# Altium schematic sheet P06 PHY 1.SchDoc
size 420 x 297 mm
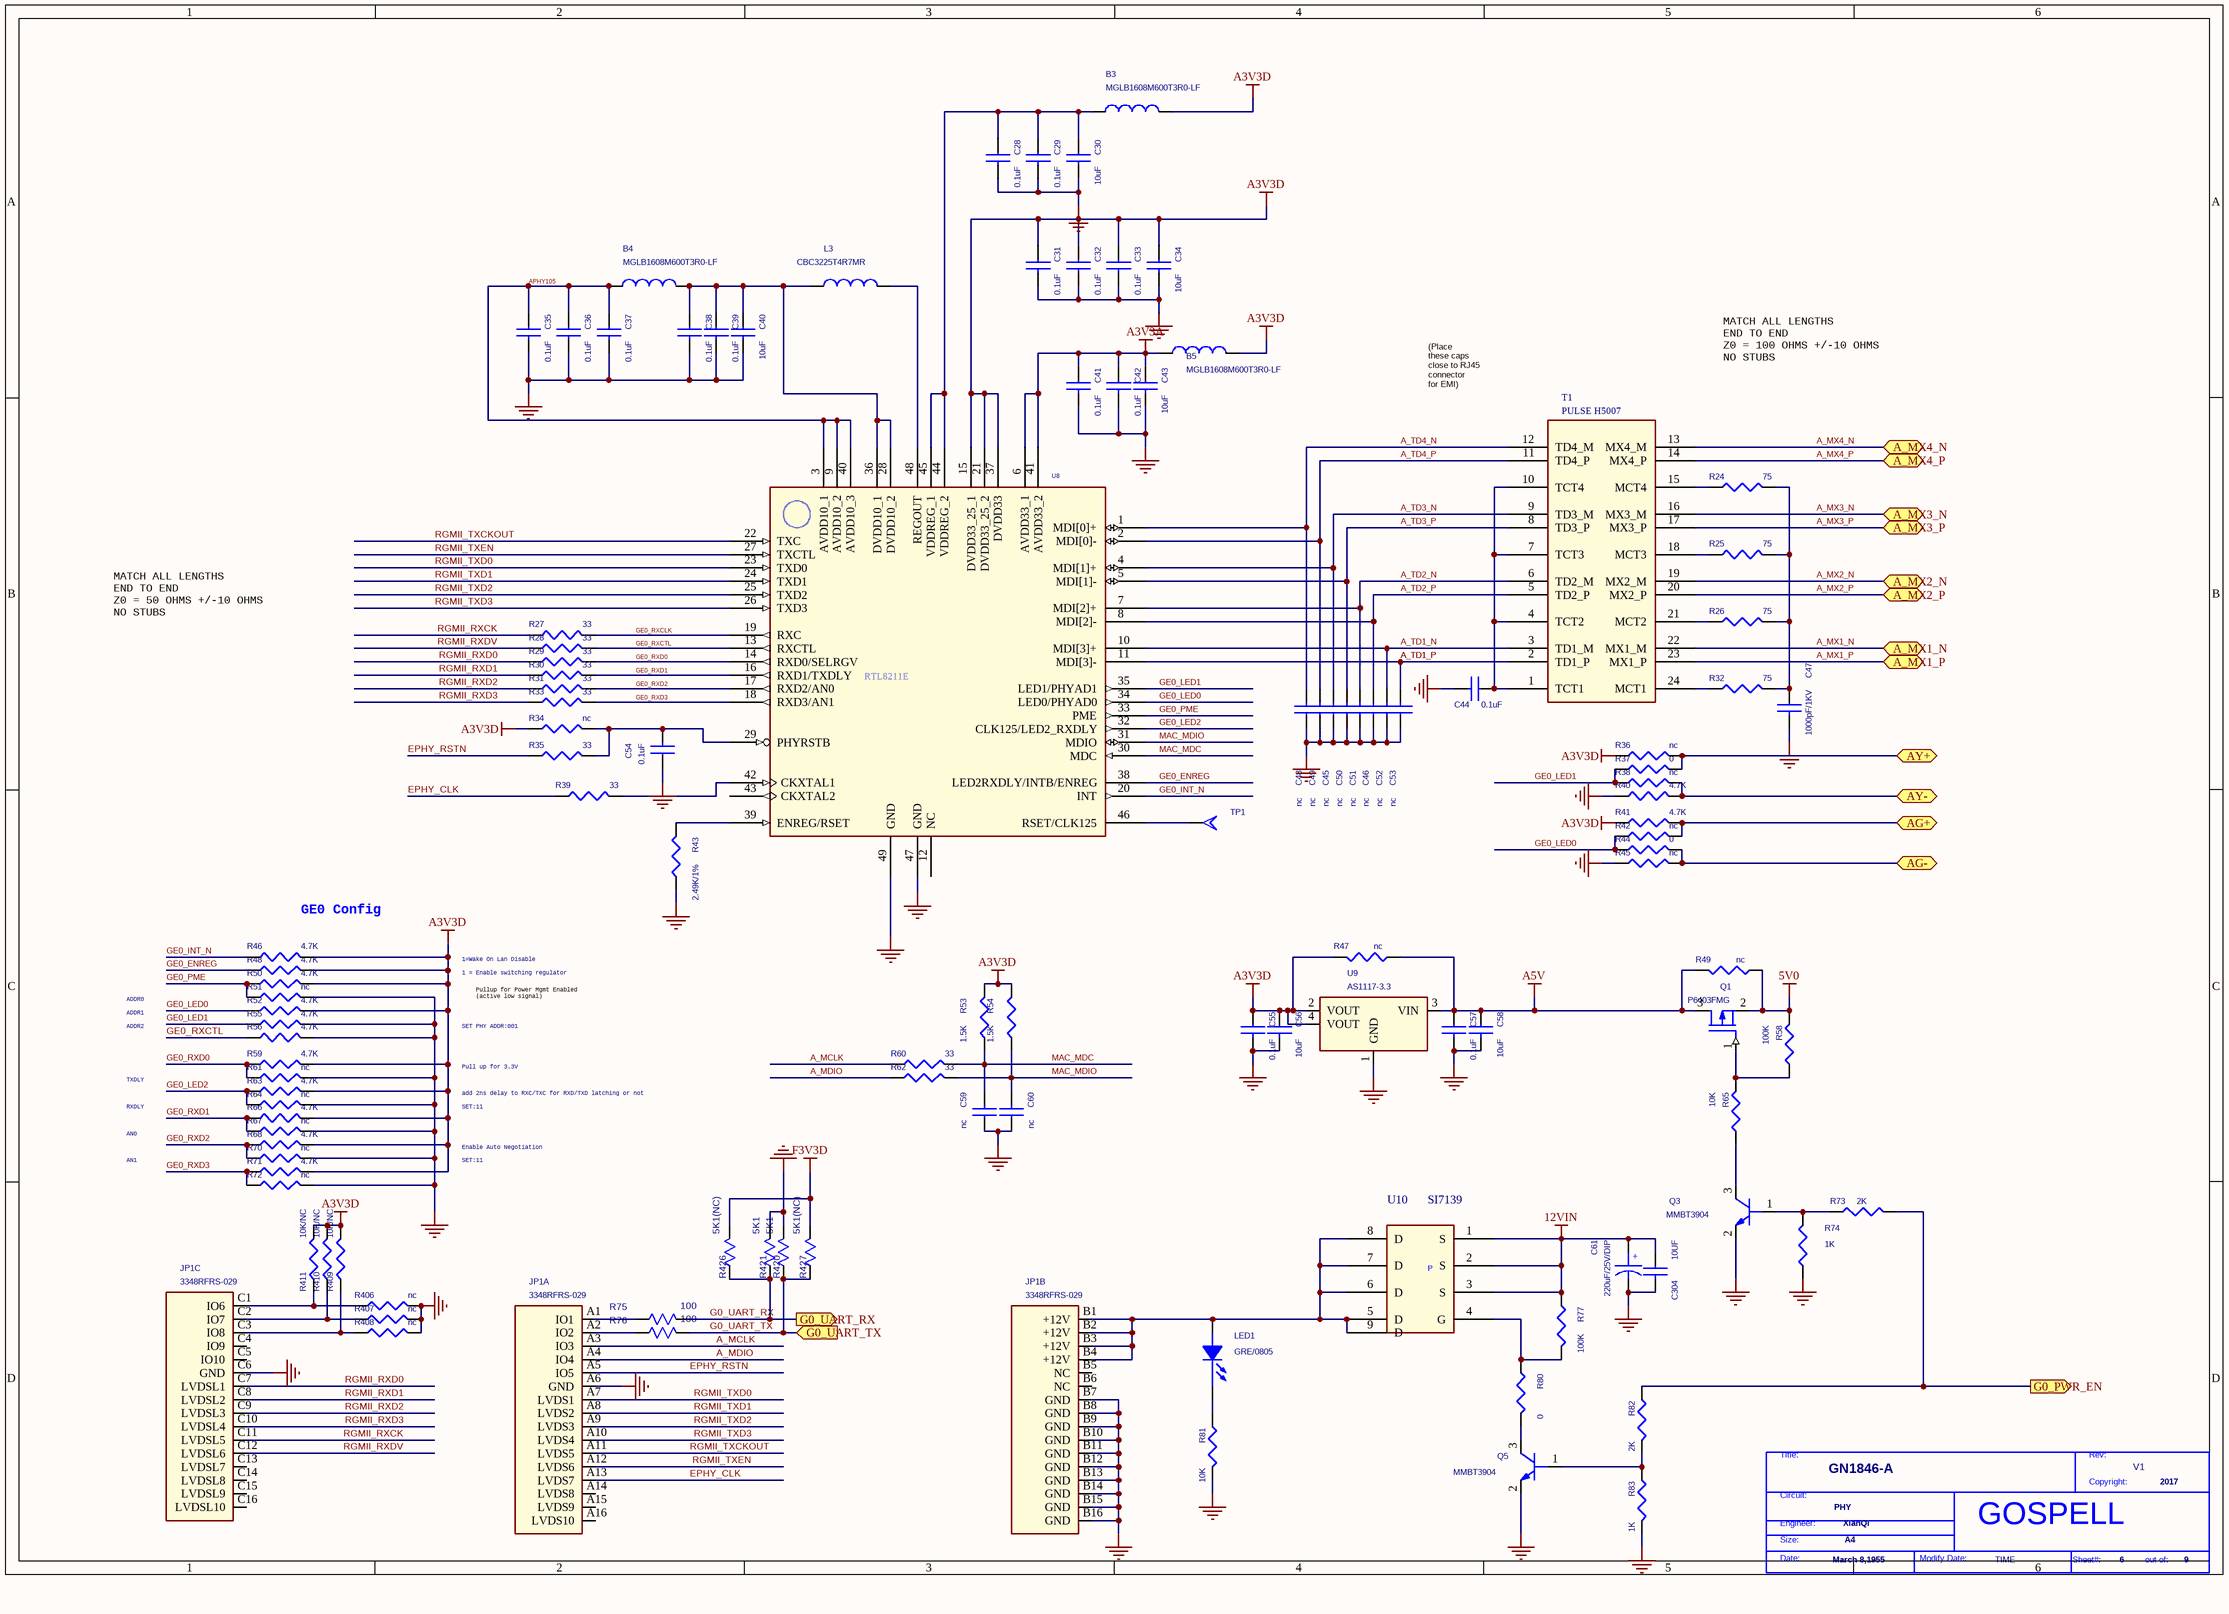
[diagram p0: P06 PHY 1.SchDoc]

## Parts
*  Doc: PHY  Page Count: 9  Page Number: 6  Page Create Date: March 8,1955  Page Size: A4  RevCode: V1  Title: GN1846-A  Copyright: 2017  Engineer: XianQi  Page Modify Date: TIME  (hidden comment: GOSPELL)  (graphical)
B3  MGLB1608M600T3R0-LF  [L0603]
B4  MGLB1608M600T3R0-LF  [L0603]
B5  MGLB1608M600T3R0-LF  [L0603]
C28  0.1uF  [0402C]
C29  0.1uF  [0402C]
C30  10uF  [C0603]
C31  0.1uF  [0402C]
C32  0.1uF  [0402C]
C33  0.1uF  [0402C]
C34  10uF  [C0603]
C35  0.1uF  [0402C]
C36  0.1uF  [0402C]
C37  0.1uF  [0402C]
C38  0.1uF  [0402C]
C39  0.1uF  [0402C]
C40  10uF  [C0603]
C41  0.1uF  [0402C]
C42  0.1uF  [0402C]
C43  10uF  [C0603]
C44  0.1uF  [0402C]
C45  nc  [0402C]
C46  nc  [0402C]
C47  1000pF/1KV  [C1206]
C48  nc  [0402C]
C49  nc  [0402C]
C50  nc  [0402C]
C51  nc  [0402C]
C52  nc  [0402C]
C53  nc  [0402C]
C54  0.1uF  [0402C]
C55  0.1uF  [0402C]
C56  10uF  [C0603]
C57  0.1uF  [0402C]
C58  10uF  [C0603]
C59  nc  [0402C]
C60  nc  [0402C]
C61  220uF/25V/DIP  [CE8X3.5]
C304  10UF  [C1206]
JP1  3348RFRS-029  [3348RFRS-029]  (parts A,B,C of 3)
L3  CBC3225T4R7MR  [FB0805]
LED1  GRE/0805  [LED0805]
Q1  P6403FMG  [SOT23]
Q3  MMBT3904  [SOT23]
Q5  MMBT3904  [SOT23]
R24  75  [0402R]
R25  75  [0402R]
R26  75  [0402R]
R27  33  [0402R]
R28  33  [0402R]
R29  33  [0402R]
R30  33  [0402R]
R31  33  [0402R]
R32  75  [0402R]
R33  33  [0402R]
R34  nc  [0402R]
R35  33  [0402R]
R36  nc  [0402R]
R37  0  [0402R]
R38  nc  [0402R]
R39  33  [0402R]
R40  4.7K  [0402R]
R41  4.7K  [0402R]
R42  nc  [0402R]
R43  2.49K/1%  [0402R]
R44  0  [0402R]
R45  nc  [0402R]
R46  4.7K  [0402R]
R47  nc  [R0603]
R48  4.7K  [0402R]
R49  nc  [R0603]
R50  4.7K  [0402R]
R51  nc  [0402R]
R52  4.7K  [0402R]
R53  1.5K  [0402R]
R54  1.5K  [0402R]
R55  4.7K  [0402R]
R56  4.7K  [0402R]
R58  100K  [0402R]
R59  4.7K  [0402R]
R60  33  [0402R]
R61  nc  [0402R]
R62  33  [0402R]
R63  4.7K  [0402R]
R64  nc  [0402R]
R65  10K  [0402R]
R66  4.7K  [0402R]
R67  nc  [0402R]
R68  4.7K  [0402R]
R70  nc  [0402R]
R71  4.7K  [0402R]
R72  nc  [0402R]
R73  2K  [0402R]
R74  1K  [0402R]
R75  100  [0402R]
R76  100  [0402R]
R77  100K  [R0603]
R80  0  [0402R]
R81  10K  [0402R]
R82  2K  [0402R]
R83  1K  [0402R]
R406  nc  [0402R]
R407  nc  [0402R]
R408  nc  [0402R]
R409  10K/NC  [0402R]
R410  10K/NC  [0402R]
R411  10K/NC  [0402R]
R420  5K1  [0402R]
R421  5K1  [0402R]
R426  5K1(NC)  [0402R]
R427  5K1(NC)  [0402R]
T1  PULSE H5007  [H5007-H]
TP1  T POINT A  [TP_G]  (value not drawn)
U8  RTL8211D  [QFN-48P-RTL8211]  (value not drawn)
U9  AS1117-3.3  [SOT223]
U10  SI7139  [PowerPAKSO8]

## Ports
A_MX1_N (bidir), A_MX1_P (bidir), A_MX2_N (bidir), A_MX2_P (bidir), A_MX3_N (bidir), A_MX3_P (bidir), A_MX4_N (bidir), A_MX4_P (bidir), AG+ (bidir), AG- (bidir), AY+ (bidir), AY- (bidir), G0_PWR_EN (out), G0_UART_RX (out), G0_UART_TX (in)

## Nets
5V0: Q1.2(SOURCE) R49.2 R58.1
12VIN: C61.1 C304.1 R77.2 U10.1(S) U10.2(S) U10.3(S)
A3V3A: B5.1 C41.1 C42.1 C43.1 U8.6(AVDD33_1) U8.41(AVDD33_2)
A3V3D: B3.2 B5.2 C31.1 C32.1 C33.1 C34.1 C55.1 C56.1 R34.1 R36.1 R41.1 R46.2 R47.1 R48.2 R50.2 R52.2 R53.2 R54.2 R59.2 R63.2 R66.2 R68.2 R71.2 R409.2 R410.2 R411.2 U8.15(DVDD33_25_1) U8.21(DVDD33_25_2) U8.37(DVDD33) U9.2(VOUT) U9.4(VOUT)
A5V: C57.1 C58.1 Q1.3(DRAIN) R47.2 R49.1 U9.3(VIN)
F3V3D: R426.2(B) R427.2(B)
GND: C28.2 C29.2 C30.2 C31.2 C32.2 C33.2 C34.2 C35.2 C36.2 C37.2 C38.2 C39.2 C40.2 C41.2 C42.2 C43.2 C44.2 C45.1 C46.1 C47.2 C48.1 C49.1 C50.1 C51.1 C52.1 C53.1 C54.1 C55.2 C56.2 C57.2 C58.2 C59.1 C60.1 C61.2 C304.2 JP1.A6(GND) JP1.B7(GND) JP1.B8(GND) JP1.B9(GND) JP1.B10(GND) JP1.B11(GND) JP1.B12(GND) JP1.B13(GND) JP1.B14(GND) JP1.B15(GND) JP1.B16(GND) JP1.C6(GND) Q3.2(EMITTER) Q5.2(EMITTER) R40.1 R43.1 R45.1 R51.2 R55.2 R56.2 R61.2 R64.2 R67.2 R70.2 R72.2 R74.1 R81.1 R83.1 R406.2 R407.2 R408.2 R420.2(B) R421.2(B) U8.47(GND) U8.49(GND) U9.1(GND)
A_MCLK: JP1.A3(IO3) R60.1
A_MDIO: JP1.A4(IO4) R62.1
A_MX1_N: T1.22(MX1_M) ; port A_MX1_N
A_MX1_P: T1.23(MX1_P) ; port A_MX1_P
A_MX2_N: T1.19(MX2_M) ; port A_MX2_N
A_MX2_P: T1.20(MX2_P) ; port A_MX2_P
A_MX3_N: T1.16(MX3_M) ; port A_MX3_N
A_MX3_P: T1.17(MX3_P) ; port A_MX3_P
A_MX4_N: T1.13(MX4_M) ; port A_MX4_N
A_MX4_P: T1.14(MX4_P) ; port A_MX4_P
A_TD1_N: C52.2 T1.3(TD1_M) U8.10(MDI[3]+)
A_TD1_P: C53.2 T1.2(TD1_P) U8.11(MDI[3]-)
A_TD2_N: C51.2 T1.6(TD2_M) U8.7(MDI[2]+)
A_TD2_P: C46.2 T1.5(TD2_P) U8.8(MDI[2]-)
A_TD3_N: C45.2 T1.9(TD3_M) U8.4(MDI[1]+)
A_TD3_P: C50.2 T1.8(TD3_P) U8.5(MDI[1]-)
A_TD4_N: C48.2 T1.12(TD4_M) U8.1(MDI[0]+)
A_TD4_P: C49.2 T1.11(TD4_P) U8.2(MDI[0]-)
AG+: R41.2 R42.2 ; port AG+
AG-: R44.2 R45.2 ; port AG-
APHY105: B4.1 C35.1 C36.1 C37.1 U8.3(AVDD10_1) U8.9(AVDD10_2) U8.40(AVDD10_3)
AY+: R36.2 R37.2 ; port AY+
AY-: R38.2 R40.2 ; port AY-
EPHY_CLK: JP1.A13(LVDS7) R39.1
EPHY_RSTN: JP1.A5(IO5) R35.1
G0_PWR_EN: R73.2 R82.2 ; port G0_PWR_EN
G0_UART_RX: R75.2(B) R421.1(A) R426.1(A) ; port G0_UART_RX
G0_UART_TX: R76.2(B) R420.1(A) R427.1(A) ; port G0_UART_TX
GE0_ENREG: R48.1 U8.38(LED2RXDLY/INTB/ENREG)
GE0_INT_N: R46.1 U8.20(INT)
GE0_LED0: R42.1 R44.1 R52.1 U8.34(LED0/PHYAD0)
GE0_LED1: R37.1 R38.1 R55.1 U8.35(LED1/PHYAD1)
GE0_LED2: R63.1 R64.1 U8.32(CLK125/LED2_RXDLY)
GE0_PME: R50.1 R51.1 U8.33(PME)
GE0_RXCLK: R27.2 U8.19(RXC)
GE0_RXCTL: R28.2 R56.1 U8.13(RXCTL)
GE0_RXD0: R29.2 R59.1 R61.1 U8.14(RXD0/SELRGV)
GE0_RXD1: R30.2 R66.1 R67.1 U8.16(RXD1/TXDLY)
GE0_RXD2: R31.2 R68.1 R70.1 U8.17(RXD2/AN0)
GE0_RXD3: R33.2 R71.1 R72.1 U8.18(RXD3/AN1)
MAC_MDC: C59.2 R53.1 R60.2 U8.30(MDC)
MAC_MDIO: C60.2 R54.1 R62.2 U8.31(MDIO)
RGMII_RXCK: JP1.C11(LVDSL5) R27.1
RGMII_RXD0: JP1.C7(LVDSL1) R29.1
RGMII_RXD1: JP1.C8(LVDSL2) R30.1
RGMII_RXD2: JP1.C9(LVDSL3) R31.1
RGMII_RXD3: JP1.C10(LVDSL4) R33.1
RGMII_RXDV: JP1.C12(LVDSL6) R28.1
RGMII_TXCKOUT: JP1.A11(LVDS5) U8.22(TXC)
RGMII_TXD0: JP1.A7(LVDS1) U8.23(TXD0)
RGMII_TXD1: JP1.A8(LVDS2) U8.24(TXD1)
RGMII_TXD2: JP1.A9(LVDS3) U8.25(TXD2)
RGMII_TXD3: JP1.A10(LVDS4) U8.26(TXD3)
RGMII_TXEN: JP1.A12(LVDS6) U8.27(TXCTL)
NetB3_1: B3.1 C28.1 C29.1 C30.1 U8.44(VDDREG_2) U8.45(VDDREG_1)
NetB4_2: B4.2 C38.1 C39.1 C40.1 L3.1 U8.28(DVDD10_2) U8.36(DVDD10_1)
NetC44_1: C44.1 T1.1(TCT1) T1.4(TCT2) T1.7(TCT3) T1.10(TCT4)
NetC47_1: C47.1 R24.2 R25.2 R26.2 R32.2
NetC54_2: C54.2 R34.2 R35.2 U8.29(PHYRSTB)
NetJP1_A1: JP1.A1(IO1) R75.1(A)
NetJP1_A2: JP1.A2(IO2) R76.1(A)
NetJP1_B1: JP1.B1(+12V) JP1.B2(+12V) JP1.B3(+12V) JP1.B4(+12V) LED1.A(ANODE) U10.5(D) U10.6(D) U10.7(D) U10.8(D) U10.9(D)
NetJP1_C1: JP1.C1(IO6) R406.1 R411.1
NetJP1_C2: JP1.C2(IO7) R407.1 R410.1
NetJP1_C3: JP1.C3(IO8) R408.1 R409.1
NetL3_2: L3.2 U8.48(REGOUT)
NetLED1_K: LED1.K(CATHODE) R81.2
NetQ1_1: Q1.1(GATE) R58.2 R65.1
NetQ3_1: Q3.1(BASE) R73.1 R74.2
NetQ3_3: Q3.3(COLLECTOR) R65.2
NetQ5_1: Q5.1(BASE) R82.1 R83.2
NetQ5_3: Q5.3(COLLECTOR) R80.1
NetR24_1: R24.1 T1.15(MCT4)
NetR25_1: R25.1 T1.18(MCT3)
NetR26_1: R26.1 T1.21(MCT2)
NetR32_1: R32.1 T1.24(MCT1)
NetR39_2: R39.2 U8.42(CKXTAL1)
NetR43_2: R43.2 U8.39(ENREG/RSET)
NetR77_1: R77.1 R80.2 U10.4(G)
NetTP1_1: TP1.1(TP) U8.46(RSET/CLK125)

Not connected (* = marked no-connect by the designer): JP1 A14(LVDS8) A15(LVDS9) A16(LVDS10) B5(NC) B6(NC) C4(IO9) C5(IO10) C13(LVDSL7) C14(LVDSL8) C15(LVDSL9) C16(LVDSL10); U8 12(NC) 43(CKXTAL2)

## Notes on the sheet
- (Place
  these caps
  close to RJ45
  connector
  for EMI)
- MATCH ALL LENGTHS
  END TO END
  Z0 = 100 OHMS +/-10 OHMS
  NO STUBS
- MATCH ALL LENGTHS
  END TO END
  Z0 = 50 OHMS +/-10 OHMS
  NO STUBS
- GE0 Config
- 1 = Enable switching regulator
- 1=Wake On Lan Disable
- Pullup for Power Mgmt Enabled
  (active low signal)
- ADDR0
- ADDR1
- ADDR2
- SET PHY ADDR:001
- Pull up for 3.3V
- TXDLY
- RXDLY
- add 2ns delay to RXC/TXC for RXD/TXD latching or not
- SET:11
- AN0
- AN1
- Enable Auto Negotiation
- (in symbol CAP POL) +
- (in symbol GOSPELL) Title:; Rev:; Copyright:; Circuit:; Engineer:; Size:; Date:; Modify Date:; Sheet#:; out of:
- (in symbol RTL8211D_2) RTL8211E
- (in symbol SI7139) P

## Library data of the parts
B3-B5 L3 = CHOKE TORROID_0
C28-C60 = CAP NP_Dup1
C61 = CAP POL
C304 = CAP NP
LED1 = LED_1
Q1 = MOSFET P_0
Q3 Q5 = 2N3904
R24-R46 R48 R50-R56 R59-R64 R66-R68 R70-R72 R77 R80-R83 R406-R411 = R_Dup1
R47 R49 R58 R65 R73 R74 = R
R75 R76 = R_1: PARTS: 1; OriginalSymbolOrigin: (10,20); PINSWAP: (A,B); DEVICE: RK73H1JTTD7502F; PKG_TYPE: SR0603; LEVEL: STD; CODE: 7091238; %195%%232%%202%%246%: 片式厚膜电阻器-0.1W-75000OHM-+/-1%-0603; %182%%238%%182%%168%%185%%166%%194%%202%(W): 0.1; %215%%232%%214%%181%%212%%202%%208%%237%%198%%171%%178%%238%: +/-1%; COMPONENT_HIGH_MAX: 0.55MM; %208%%161%%192%%224%%195%%251%%179%%198%: 片式厚膜电阻器
R420 R421 R426 R427 = R_1: PARTS: 1; OriginalSymbolOrigin: (10,20); PINSWAP: (A,B); DEVICE: RK73H1JTTD7502F; PKG_TYPE: SR0603; LEVEL: STD; %208%%161%%192%%224%%195%%251%%179%%198%: 片式厚膜电阻器; COMPONENT_HIGH_MAX: 0.55MM; %215%%232%%214%%181%%212%%202%%208%%237%%198%%171%%178%%238%: +/-1%; %182%%238%%182%%168%%185%%166%%194%%202%(W): 0.1; %195%%232%%202%%246%: 片式厚膜电阻器-0.1W-75000OHM-+/-1%-0603; CODE: 7091238
T1 = PULSE H5007_0
U8 = RTL8211D_2
U9 = AS1117-X_3
* = GOSPELL: Cage Code: 2017; Schematic Page Count: 9; Schematic Page Number: 6